# EAGLE design RelayController (EAGLE 7.5.0)
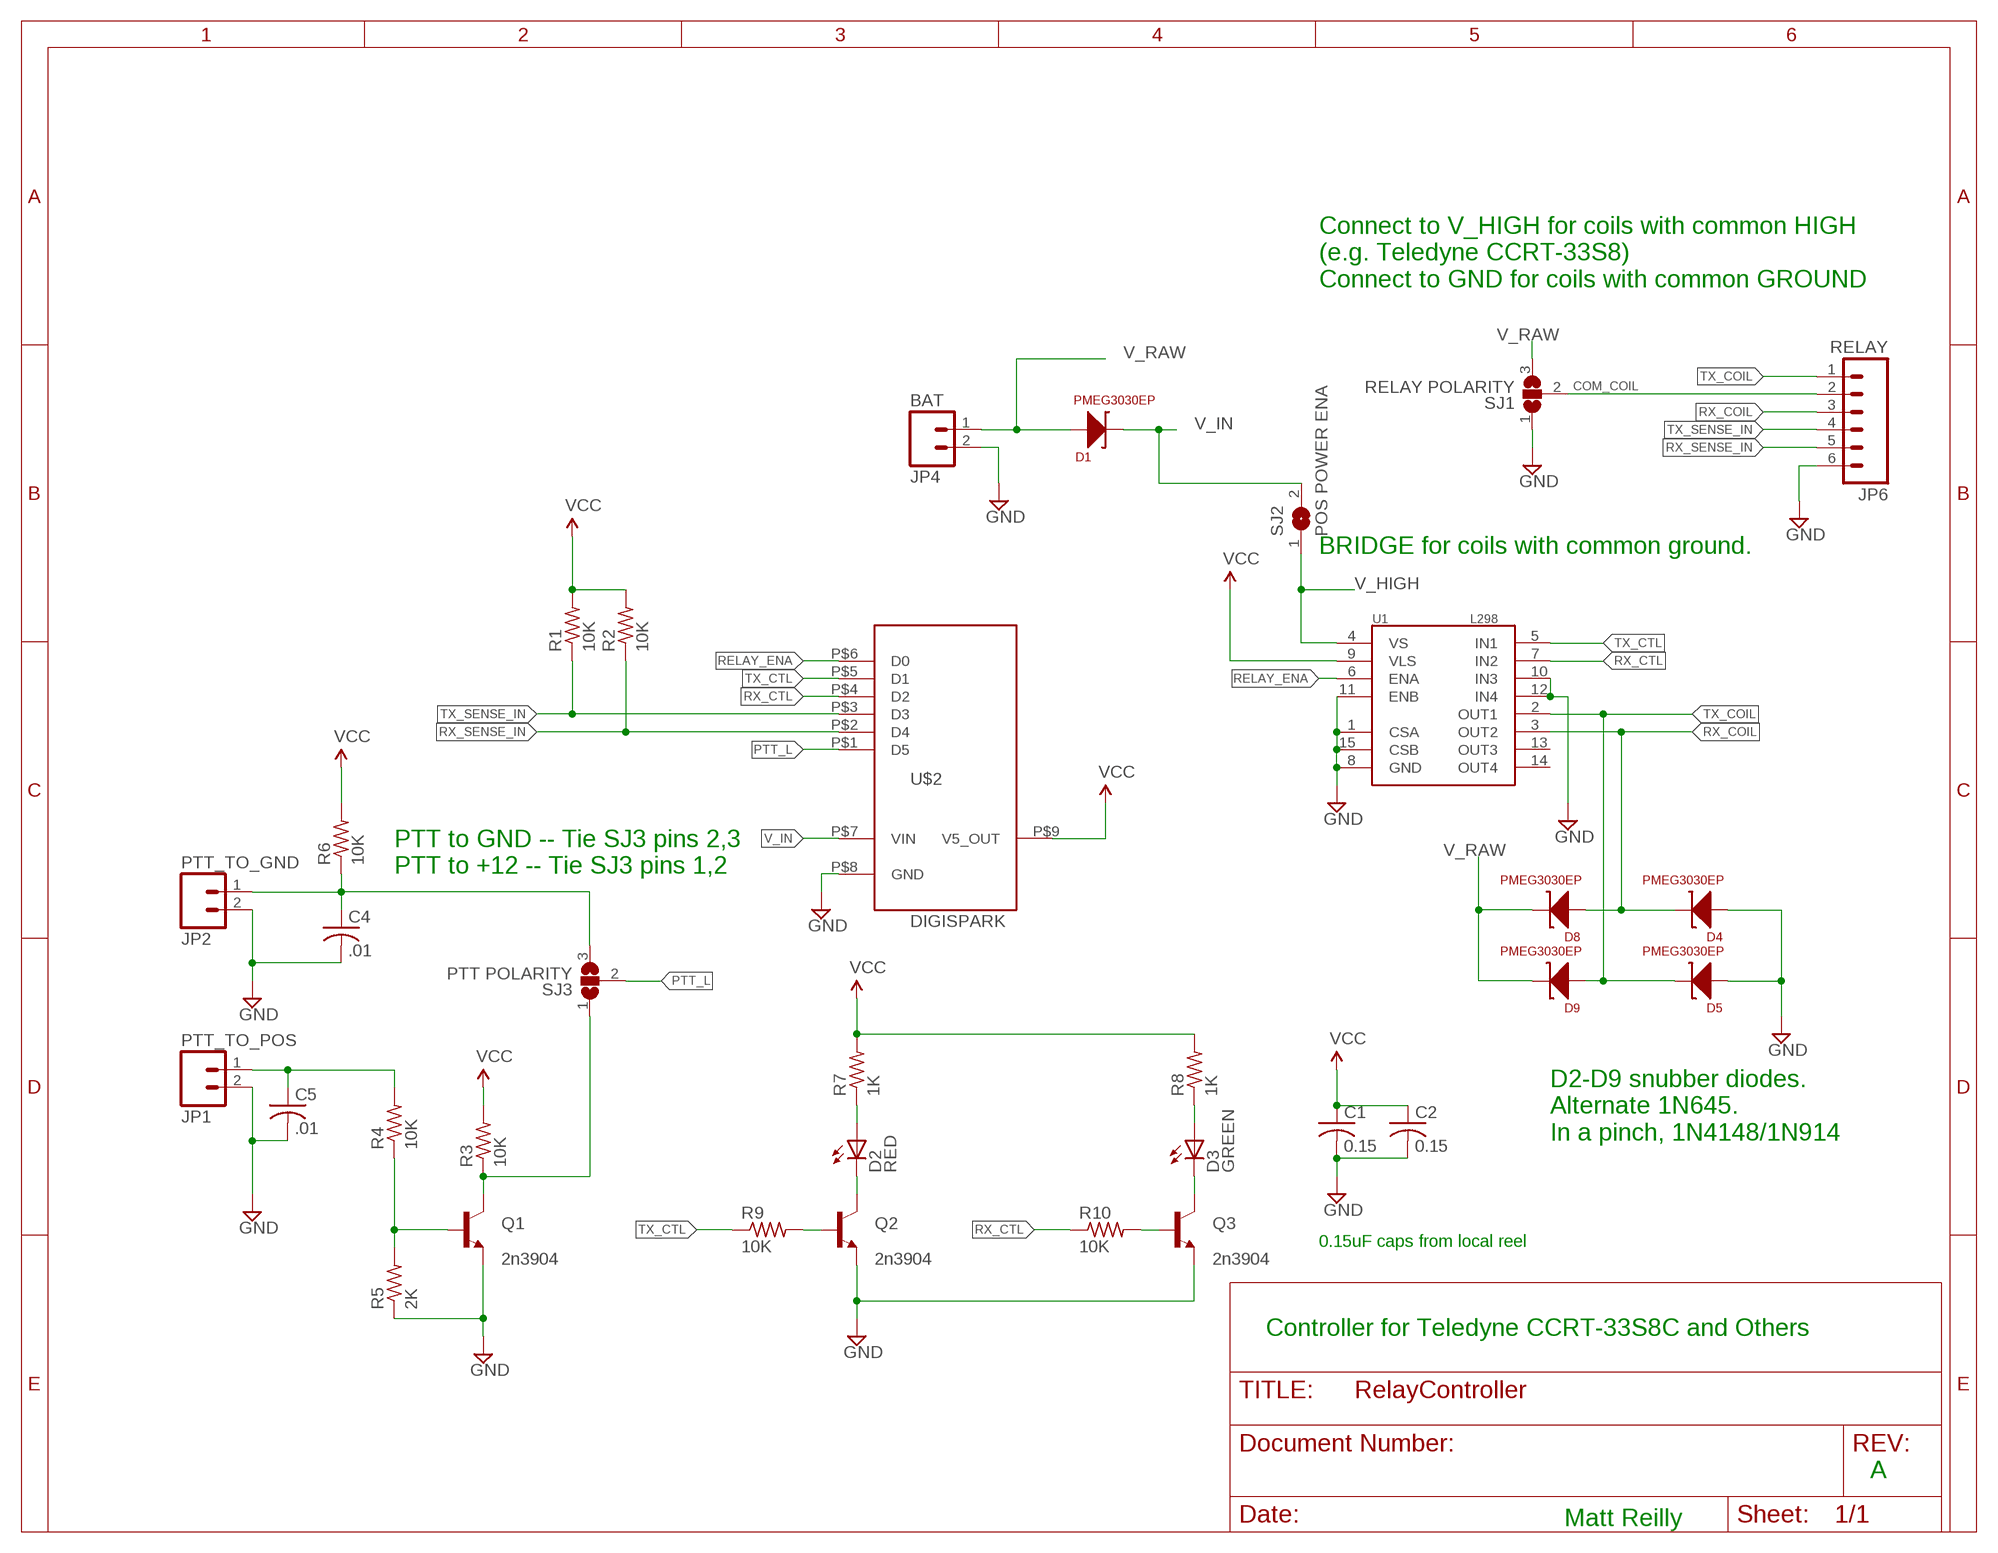
[diagram p0: schematic, sheet 1]

## Parts
C1  0.15  C-USC1206K  [C1206K]
C2  0.15  C-USC1206K  [C1206K]
C4  .01  C-USC1206K  [C1206K]
C5  .01  C-USC1206K  [C1206K]
D1  PMEG3030EP  [SOD128]
D2  RED  LED3MM  [LED3MM]
D3  GREEN  LED3MM  [LED3MM]
D4  PMEG3030EP  [SOD128]
D5  PMEG3030EP  [SOD128]
D8  PMEG3030EP  [SOD128]
D9  PMEG3030EP  [SOD128]
JP1  PTT_TO_POS  M025MM  [SCREWTERMINAL-5MM-2]
JP2  PTT_TO_GND  M025MM  [SCREWTERMINAL-5MM-2]
JP4  BAT  M025MM  [SCREWTERMINAL-5MM-2]
JP6  RELAY  M06POLAR  [MOLEX-1X6]
Q1  2n3904  2N3904  [TO92]
Q2  2n3904  2N3904  [TO92]
Q3  2n3904  2N3904  [TO92]
R1  10K  R-US_R1206  [R1206]
R2  10K  R-US_R1206  [R1206]
R3  10K  R-US_R1206  [R1206]
R4  10K  R-US_R1206  [R1206]
R5  2K  R-US_R1206  [R1206]
R6  10K  R-US_R1206  [R1206]
R7  1K  R-US_R1206  [R1206]
R8  1K  R-US_R1206  [R1206]
R9  10K  R-US_R1206  [R1206]
R10  10K  R-US_R1206  [R1206]
SJ1  RELAY POLARITY  SJ2WW  [SJ_2W]
SJ2  POS POWER ENA  SJW  [SJW]
SJ3  PTT POLARITY  SJ2WW  [SJ_2W]
U1  L298  [MULTIWATT15]
U$2  DIGISPARK  [DIGISPARK_FP]

## Nets
COM_COIL: JP6.2 SJ1.2
GND: C1.2 C2.2 C4.2 C5.2 D4.P$1(A) D5.P$1(A) JP1.2 JP2.2 JP4.2 JP6.6 Q1.3(E) Q2.3(E) Q3.3(E) R5.1 SJ1.1 U1.1(CSA) U1.8(GND) U1.10(IN3) U1.11(ENB) U1.12(IN4) U1.15(CSB) U$2.P$8(GND)
N$1: C5.1 JP1.1 R4.2
N$2: Q1.1(C) R3.1 SJ3.1
N$3: D3.A R8.1
N$4: Q1.2(B) R4.1 R5.2
N$5: C4.1 JP2.1 R6.1 SJ3.3
N$6: D2.A R7.1
N$7: D2.K(C) Q2.1(C)
N$8: D3.K(C) Q3.1(C)
N$9: Q2.2(B) R9.2
N$10: Q3.2(B) R10.2
PTT_L: SJ3.2 U$2.P$1(D5)
RELAY_ENA: U1.6(ENA) U$2.P$6(D0)
RX_COIL: D4.P$2(C) D8.P$1(A) JP6.3 U1.3(OUT2)
RX_CTL: R10.1 U1.7(IN2) U$2.P$4(D2)
RX_SENSE_IN: JP6.5 R2.1 U$2.P$2(D4)
TX_COIL: D5.P$2(C) D9.P$1(A) JP6.1 U1.2(OUT1)
TX_CTL: R9.1 U1.5(IN1) U$2.P$5(D1)
TX_SENSE_IN: JP6.4 R1.1 U$2.P$3(D3)
V_HIGH: SJ2.1 U1.4(VS)
V_IN: D1.P$2(C) SJ2.2 U$2.P$7(VIN)
V_RAW: D1.P$1(A) D8.P$2(C) D9.P$2(C) JP4.1 SJ1.3
VCC: C1.1 C2.1 R1.2 R2.2 R3.2 R6.2 R7.2 R8.2 U1.9(VLS) U$2.P$9(V5_OUT)
Unconnected: U1.13(OUT3) U1.14(OUT4)

## Notes on the sheet
- Connect to V_HIGH for coils with common HIGH
  (e.g. Teledyne CCRT-33S8)
  Connect to GND for coils with common GROUND
- BRIDGE for coils with common ground.
- PTT to GND -- Tie SJ3 pins 2,3
  PTT to +12 -- Tie SJ3 pins 1,2
- D2-D9 snubber diodes. 
  Alternate 1N645. 
  In a pinch, 1N4148/1N914
- 0.15uF caps from local reel
- Controller for Teledyne CCRT-33S8C and Others
- A
- Matt Reilly

## Library data of the parts
C1 C2 C4 C5 = resistor:C-US: CAPACITOR, American symbol
D1 D4 D5 D8 D9 = kb1vc_robot_parts:PMEG3030EP
D2 D3 = led:LED: LED OSRAM: - CHIPLED LG R971, LG N971, LY N971, LG Q971, LY Q971, LO R971, LY R971 LH N974, LH R974 LS Q976, LO Q976, LY Q976 LO Q996 - Hyper CHIPLED LW Q18S LB Q993, LB Q99A, LB R99A - SideLED LS A670, LO A670, LY A670, LG A670, LP A670 LB A673, LV A673, LT A673, LW A673 LH A674 LY A675 LS A676, LA A676, LO A676, LY A676, LW A676 LS A679, LY A679, LG A679 - Hyper Micro SIDELED® LS Y876, LA Y876, LO Y876, LY Y876 LT Y87S - SmartLED LW L88C, LW L88S LB L89C, LB L89S, LG L890 LS L89K, LO L89K, LY L89K LS L896, LA L896, LO L896, LY L896 - TOPLED LS T670, LO T670, LY T670, LG T670, LP T670 LSG T670, LSP T670, LSY T670, LOP T670, LYG T670 LG T671, LOG T671, LSG T671 LB T673, LV T673, LT T673, LW T673 LH T674 LS T676, LA T676, LO T676, LY T676, LB T676, LH T676, LSB T676, LW T676 LB T67C, LV T67C, LT T67C, LS T67K, LO T67K, LY T67K, LW E67C LS E67B, LA E67B, LO E67B, LY E67B, LB E67C, LV E67C, LT E67C LW T67C LS T679, LY T679, LG T679 LS T770, LO T770, LY T770, LG T770, LP T770 LB T773, LV T773, LT T773, LW T773 LH T774 LS E675, LA E675, LY E675, LS T675 LS T776, LA T776, LO T776, LY T776, LB T776 LHGB T686 LT T68C, LB T68C - Hyper Mini TOPLED® LB M676 - Mini TOPLED Santana® LG M470 LS M47K, LO M47K, LY M47K Source: http://www.osram.convergy.de LUXEON: - LUMILED® LXK2-PW12-R00, LXK2-PW12-S00, LXK2-PW14-U00, LXK2-PW14-V00 LXK2-PM12-R00, LXK2-PM12-S00, LXK2-PM14-U00 LXK2-PE12-Q00, LXK2-PE12-R00, LXK2-PE12-S00, LXK2-PE14-T00, LXK2-PE14-U00 LXK2-PB12-K00, LXK2-PB12-L00, LXK2-PB12-M00, LXK2-PB14-N00, LXK2-PB14-P00, LXK2-PB14-Q00 LXK2-PR12-L00, LXK2-PR12-M00, LXK2-PR14-Q00, LXK2-PR14-R00 LXK2-PD12-Q00, LXK2-PD12-R00, LXK2-PD12-S00 LXK2-PH12-R00, LXK2-PH12-S00 LXK2-PL12-P00, LXK2-PL12-Q00, LXK2-PL12-R00 Source: www.luxeon.com KINGBRIGHT: KA-3528ASYC Source: www.kingbright.com
JP1 JP2 JP4 = SparkFun-Connectors:M02: Standard 2-pin 0.1" header. Use with - straight break away headers ( PRT-00116) - right angle break away headers (PRT-00553) - swiss pins (PRT-00743) - machine pins (PRT-00117) - female headers (PRT-00115) Molex polarized connector foot print use with: PRT-08233 with associated crimp pins and housings. 2.54_SCREWTERM for use with PRT-10571. 3.5mm Screw Terminal footprints for PRT-08084 5mm Screw Terminal footprints for use with PRT-08432; STOREFRONT_ID: PRT-08432
JP6 = SparkFun-Connectors:M06: Header 6 Standard 6-pin 0.1" header. Use with straight break away headers (SKU : PRT-00116), right angle break away headers (PRT-00553), swiss pins (PRT-00743), machine pins (PRT-00117), and female headers (PRT-00115). Molex polarized connector foot print use with SKU : PRT-08094 with associated crimp pins and housings. NOTES ON THE VARIANTS LOCK and LOCK_LONGPADS... This footprint was designed to help hold the alignment of a through-hole component (i.e. 6-pin header) while soldering it into place. You may notice that each hole has been shifted either up or down by 0.005 of an inch from it's more standard position (which is a perfectly straight line). This slight alteration caused the pins (the squares in the middle) to touch the edges of the holes. Because they are alternating, it causes a "brace" to hold the component in place. 0.005 has proven to be the perfect amount of "off-center" position when using our standard breakaway headers. Although looks a little odd when you look at the bare footprint, once you have a header in there, the alteration is very hard to notice. Also,if you push a header all the way into place, it is covered up entirely on the bottom side. This idea of altering the position of holes to aid alignment will be further integrated into the Sparkfun Library for other footprints. It can help hold any component with 3 or more connection pins.
Q1-Q3 = transistor:2N3904: NPN TRANSISTOR
R1-R10 = rcl:R-US_: RESISTOR, American symbol
SJ1 SJ3 = jumper:SJ2W: SMD solder JUMPER
SJ2 = jumper:SJ: SMD solder JUMPER
U1 = SparkFun-PowerIC:L298: L298 Dual Full Bridge Driver
U$2 = kb1vc_Arduino_Parts:DIGISPARK: Digispark -- ATTiny arduino with minimal footprint

## Board
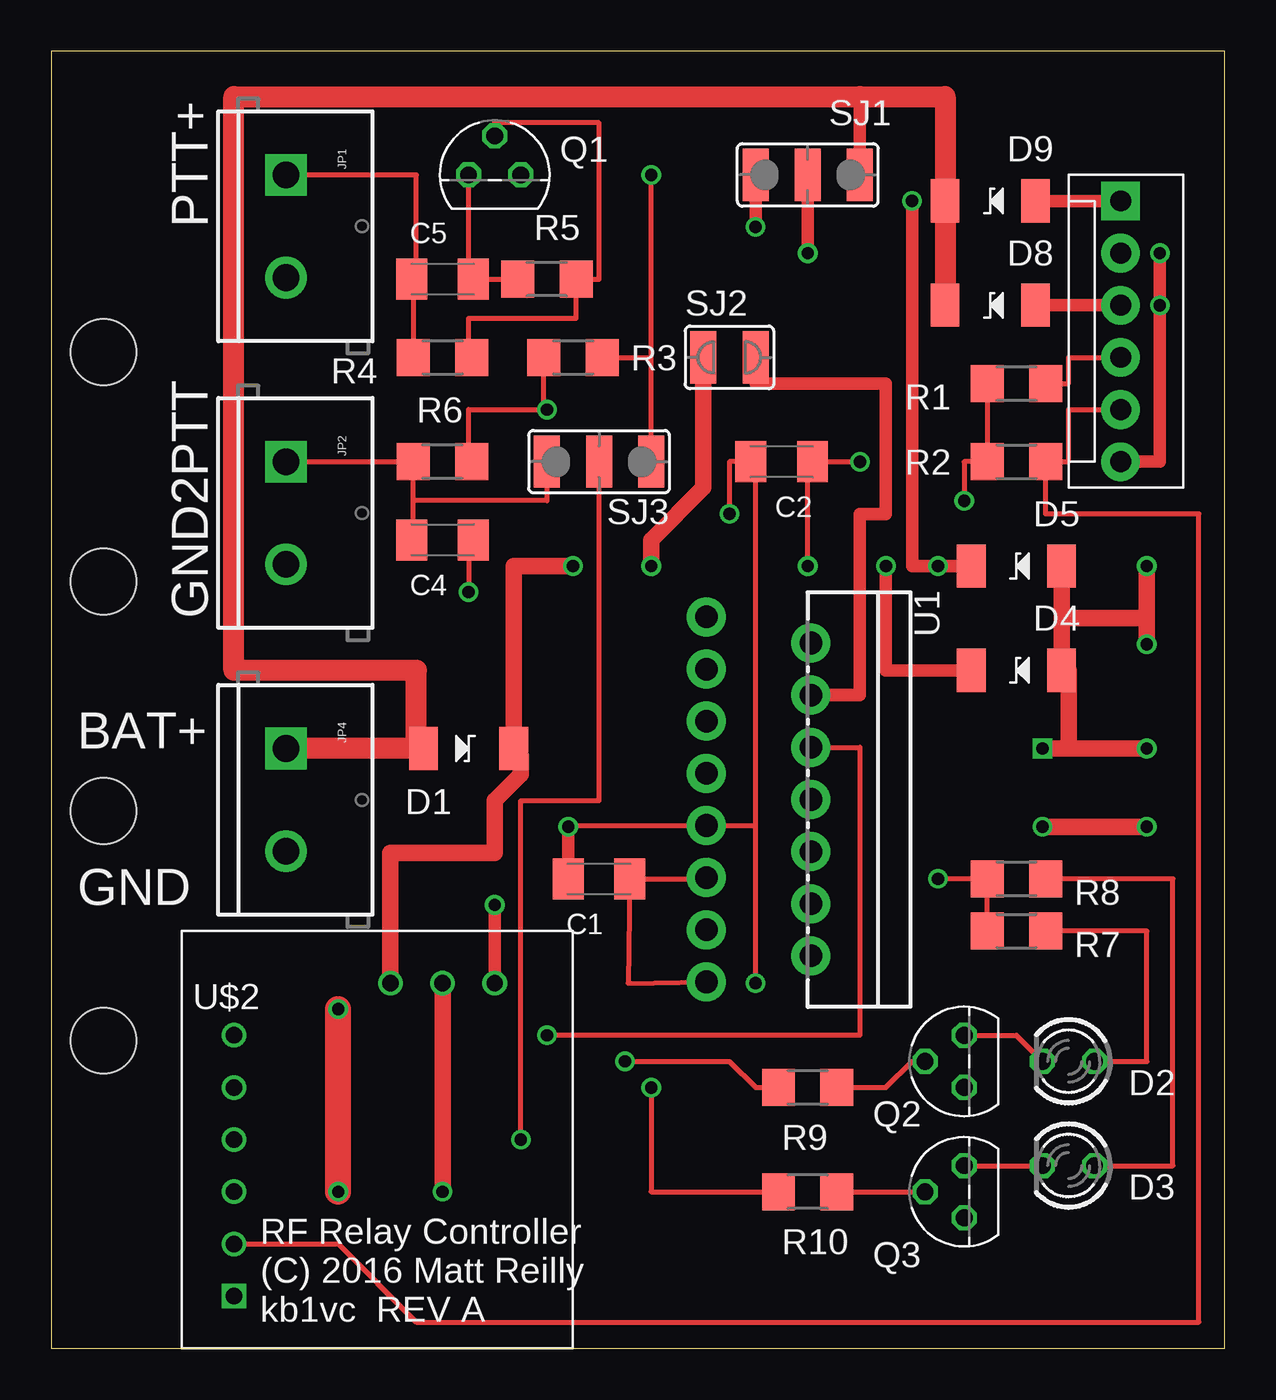
[diagram p1: board, top side]
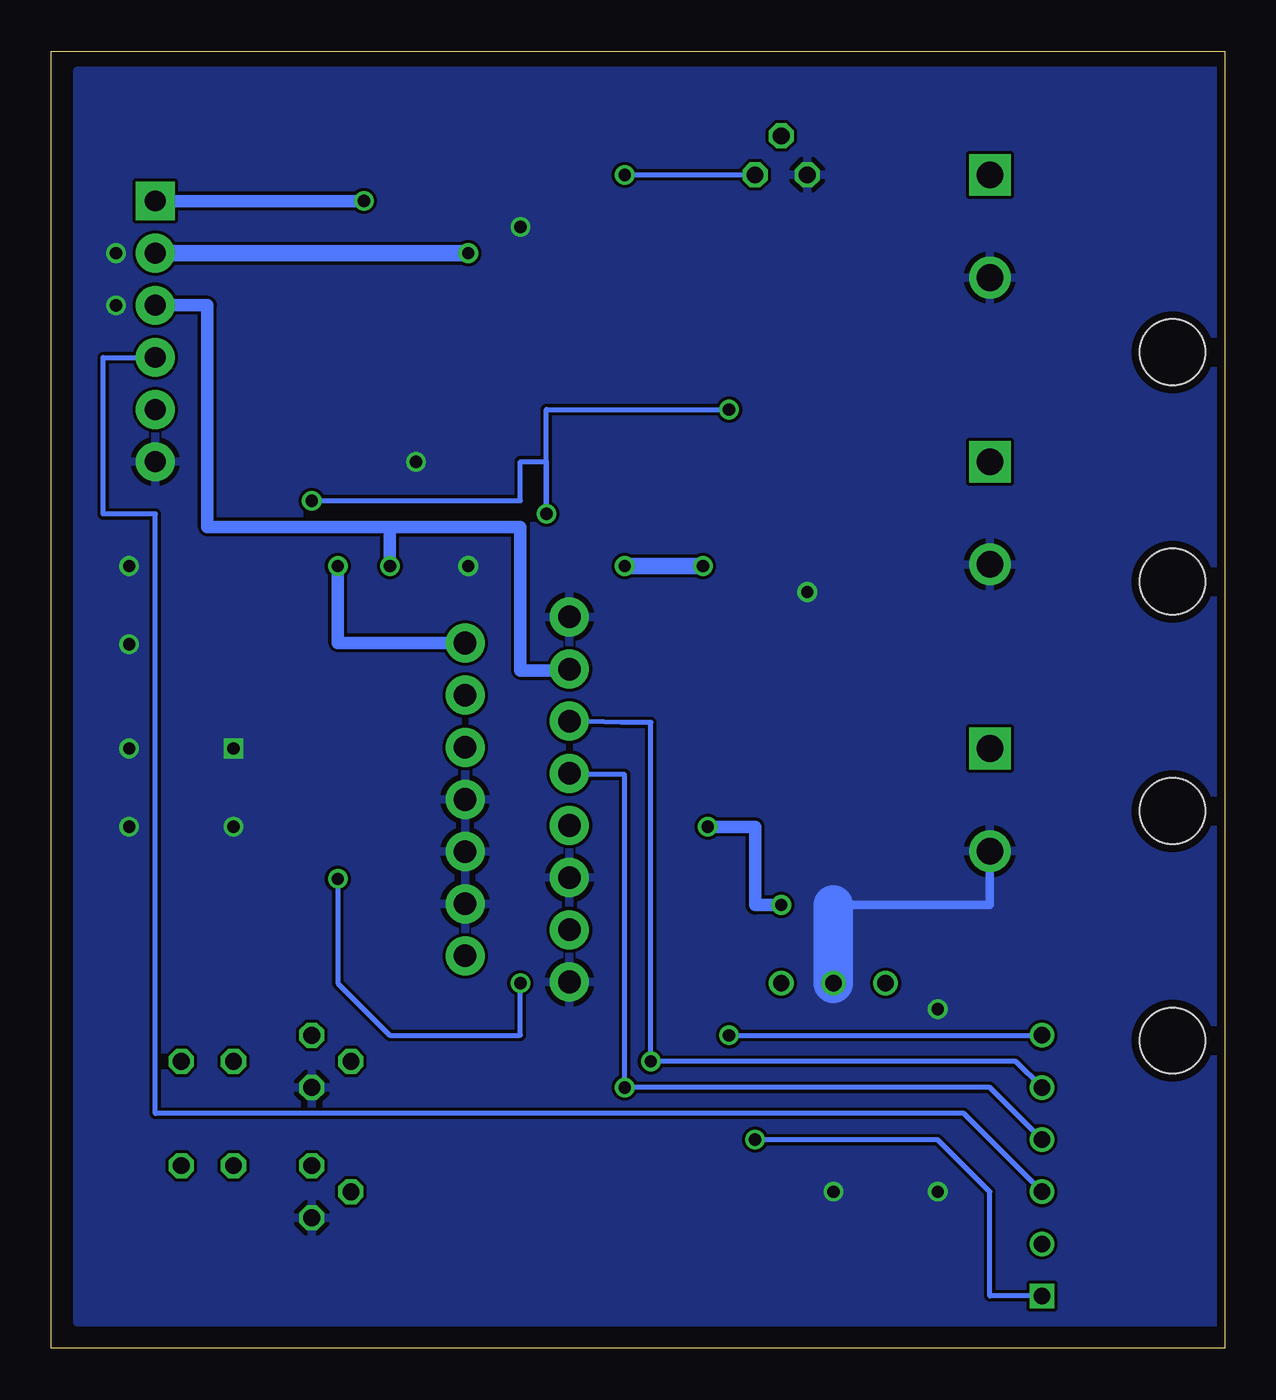
[diagram p2: board, bottom side, seen from below]

Size 57.13 x 63.17 mm. Coordinates in mm from the lower left corner, seen from the top.
Outline: 0,0 57.13,0 57.13,63.17 0,63.17 0,0
Copper layers (1*16): Top 0.0356mm / dielectric 1.5011mm / Bottom 0.0356mm
Design rules "oshpark-2layer": minimum track width 6mil, minimum drill 13mil, track to track 6mil, track to pad 6mil, pad to pad 6mil, via to via 6mil, smd to smd 6mil, copper to edge 15mil, drill to drill 6mil, minimum pad ring 7mil, minimum via ring 7mil, stop-mask expansion 2.5mil, vias tented up to drill 0mil, thermal gap 10mil
Holes 3.2 mm at 2.54,14.99 2.54,26.16 2.54,37.34 2.54,48.51

### Footprints (pad centres in the part's own frame; a part is rotated, then mirrored left to right if it is on the bottom)
C1206K = smd 1.5 x 2: 1 -1.5,0; 2 1.5,0
SOD128 = smd 1.4 x 2.1: P$1 -2.2,0; P$2 2.2,0
LED3MM = drill 0.813 octagon: A -1.27,0; K 1.27,0
SCREWTERMINAL-5MM-2 = drill 1.3 pad 2.032 square: 1 0,0 | drill 1.3 pad 2.032: 2 5,0
MOLEX-1X6 = drill 1.016 pad 1.88 square: 1 0,0 | drill 1.016 pad 1.88: 2 2.54,0; 3 5.08,0; 4 7.62,0; 5 10.16,0; 6 12.7,0
TO92 = drill 0.813 octagon: 1 1.27,0; 2 0,1.905; 3 -1.27,0
R1206 = smd 1.6 x 1.803: 1 -1.422,0; 2 1.422,0
SJ_2W = smd 1.27 x 2.54: 1 -2.54,0; 2 0,0; 3 2.54,0
SJW = smd 1.27 x 2.54: 1 -1.27,0; 2 1.27,0
MULTIWATT15 = drill 1.1 pad 1.9: 1 -8.95,-2.39; 2 -7.68,2.69; 3 -6.41,-2.39; 4 -5.14,2.69; 5 -3.87,-2.39; 6 -2.6,2.69; 7 -1.33,-2.39; 8 -0.06,2.69; 9 1.21,-2.39; 10 2.48,2.69; 11 3.75,-2.39; 12 5.02,2.69; 13 6.29,-2.39; 14 7.56,2.69; 15 8.83,-2.39
DIGISPARK_FP = drill 0.8 square: P$1 6.35,6.35 | drill 0.8: P$2 6.35,3.81; P$3 6.35,1.27; P$4 6.35,-1.27; P$5 6.35,-3.81; P$6 6.35,-6.35; P$7 -1.27,-8.89; P$8 -3.81,-8.89; P$9 -6.35,-8.89

### Placement (x,y rotation side)
C1  26.67,22.86 0 top
C2  35.56,43.18 0 top
C4  19.05,39.37 0 top
C5  19.05,52.07 0 top
D1  20.32,29.21 0 top
D2  49.53,13.97 180 top
D3  49.53,8.89 180 top
D4  46.99,33.02 180 top
D5  46.99,38.1 180 top
D8  45.72,50.8 180 top
D9  45.72,55.88 180 top
JP1  11.43,57.15 270 top
JP2  11.43,43.18 270 top
JP4  11.43,29.21 270 top
JP6  52.07,55.88 270 top
Q1  21.59,57.15 0 top
Q2  44.45,13.97 90 top
Q3  44.45,7.62 90 top
R1  46.99,46.99 180 top
R2  46.99,43.18 180 top
R3  25.4,48.26 180 top
R4  19.05,48.26 180 top
R5  24.13,52.07 0 top
R6  19.05,43.18 0 top
R7  46.99,20.32 180 top
R8  46.99,22.86 180 top
R9  36.83,12.7 0 top
R10  36.83,7.62 0 top
SJ1  36.83,57.15 0 top
SJ2  33.02,48.26 180 top
SJ3  26.67,43.18 180 top
U1  34.29,26.67 270 top
U$2  15.24,8.89 180 top

### Tracks (layer width: path | path; a pad name or v marks a point on that pad's centre or on a via)
COM_COIL  (via drill 0.6)
  Top 0.61: v36.83,53.34 SJ1.2
  Bottom 0.813: JP6.2 v36.83,53.34
GND  (via drill 0.6)
  Top 0.254: U1.15 28.09,17.78 C1.2 31.9,22.86 U1.11 | C4.2 20.32,39.37 v20.32,36.83 | R5.1 C5.2 20.32,52.07 Q1.3 | C2.2 v39.37,43.18 36.83,43.18 v36.83,38.1
  Top 0.61: SJ1.1 v34.29,54.61 | JP6.6 53.98,43.18 v53.98,50.8 v53.98,53.34
  Top 0.813: D5.P$1 D4.P$1 49.53,33.02 49.53,29.21 v48.26,29.21 v53.34,29.21 | 53.34,35.56 v53.34,38.1 | v53.34,25.4 v48.26,25.4 | v53.34,34.29 53.34,35.56 | 53.34,35.56 49.53,35.56 | v19.05,7.62 U$2.P$8
  Top 1.27: v13.97,7.62 v13.97,16.51
  Bottom 0.406: 19.05,21.59 11.43,21.59 JP4.2
  Bottom 1.93: U$2.P$8 19.05,21.59
  pour Bottom: 0,62.23 55.88,62.23 55.88,1.27 0,1.27
N$1
  Top 0.254: JP1.1 17.78,57.15 17.78,52.07 C5.1 17.63,52.07 R4.2
N$2  (via drill 0.6)
  Top 0.254: SJ3.1 29.21,48.26 | R3.1 29.21,48.26 | 29.21,48.26 v29.21,57.15
  Bottom 0.254: v29.21,57.15 Q1.1
N$3
  Top 0.254: D3.A 54.61,8.89 54.61,22.86 R8.1
N$4
  Top 0.254: Q1.2 21.59,59.69 26.67,59.69 26.67,52.07 R5.2 25.55,50.16 20.32,50.16 20.32,48.26 R4.1
N$5
  Top 0.254: JP2.1 R6.1 17.63,41.27 | C4.1 17.63,39.37 17.63,41.27 | SJ3.3 24.13,41.27 17.63,41.27
N$6
  Top 0.254: D2.A 53.34,13.97 53.34,20.32 R7.1
N$7
  Top 0.254: Q2.1 46.99,15.24 D2.K
N$8
  Top 0.254: Q3.1 D3.K
N$9
  Top 0.254: R9.2 40.64,12.7 41.91,13.97 Q2.2
N$10
  Top 0.254: R10.2 Q3.2
PTT_L  (via drill 0.6)
  Top 0.254: v22.86,10.16 22.86,26.67 26.67,26.67 SJ3.2
  Bottom 0.254: U$2.P$1 11.43,2.54 11.43,7.62 13.97,10.16 v22.86,10.16
RELAY_ENA  (via drill 0.6)
  Top 0.254: U1.6 39.37,29.27 39.37,15.24 v24.13,15.24
  Bottom 0.254: v24.13,15.24 U$2.P$6
RX_COIL  (via drill 0.6)
  Top 0.61: JP6.3 D8.P$1 | D4.P$2 40.64,33.02 v40.64,38.1
  Bottom 0.254: 31.9,33.02 U1.3
  Bottom 0.61: v40.64,38.1 40.64,40.01 | 40.64,40.01 34.29,40.01 34.29,33.02 31.9,33.02 | 40.64,40.01 49.53,40.01 49.53,50.8 JP6.3
RX_CTL  (via drill 0.6)
  Top 0.254: v29.21,12.7 29.21,7.62 R10.1
  Bottom 0.254: U$2.P$4 11.43,12.7 v29.21,12.7 29.21,27.94 31.9,27.94 U1.7
RX_SENSE_IN
  Top 0.254: U$2.P$2 13.97,5.08 17.78,1.27 55.88,1.27 55.88,40.64 48.41,40.64 R2.1 49.53,43.18 49.53,45.72 JP6.5
TX_COIL  (via drill 0.6)
  Top 0.61: JP6.1 D9.P$1 | v43.18,38.1 D5.P$2 41.91,38.1 v41.91,55.88
  Bottom 0.61: U1.2 43.18,34.35 v43.18,38.1 | v41.91,55.88 JP6.1
TX_CTL  (via drill 0.6)
  Top 0.254: v27.94,13.97 33.02,13.97 34.29,12.7 R9.1
  Bottom 0.254: U$2.P$5 10.16,13.97 v27.94,13.97 27.94,30.48 29.36,30.48 U1.5
TX_SENSE_IN
  Top 0.254: R1.1 49.53,46.99 49.53,48.26 JP6.4
  Bottom 0.254: U$2.P$3 12.7,11.43 52.07,11.43 52.07,40.64 54.61,40.64 54.61,48.26 JP6.4
V_HIGH
  Top 0.61: SJ2.1 34.29,46.99 40.64,46.99 40.64,40.64 39.37,40.64 39.37,31.81 U1.4
V_IN  (via drill 0.6)
  Top 0.813: U$2.P$7 16.51,24.13 21.59,24.13 21.59,26.67 22.86,27.94 22.86,28.87 D1.P$2 22.52,38.1 v25.4,38.1 | v29.21,38.1 29.21,39.37 31.75,41.91 SJ2.2
  Bottom 0.813: v25.4,38.1 v29.21,38.1
V_RAW
  Top 0.61: SJ1.3 39.37,60.96
  Top 1.016: JP4.1 D1.P$1 17.78,29.21 17.78,33.02 8.89,33.02 8.89,60.96 39.37,60.96 43.52,60.96 D9.P$2 D8.P$2
VCC  (via drill 0.6)
  Top 0.254: R6.2 20.32,43.18 20.32,45.72 23.98,45.72 | v33.02,40.64 33.02,43.18 C2.1 34.29,43.18 34.29,25.46 | v24.13,45.72 23.98,45.72 | 23.98,45.72 R3.2 | R1.2 R2.2 44.45,43.18 v44.45,41.27 | 34.29,25.46 U1.9 25.4,25.46 25.4,25.4 v25.17,25.4 | R7.2 R8.2 v43.18,22.86 | v34.29,17.78 34.29,25.46
  Top 0.61: U$2.P$9 v21.59,21.59 | v25.17,25.4 C1.1
  Bottom 0.254: v24.13,45.72 33.02,45.72 v33.02,40.64 33.02,43.18 34.29,43.18 34.29,41.27 v44.45,41.27 | v43.18,22.86 43.18,17.78 40.64,15.24 34.29,15.24 v34.29,17.78
  Bottom 0.61: v21.59,21.59 22.86,21.59 22.86,25.4 v25.17,25.4

### Text on the board
tNames: PTT+ | GND2PTT | BAT+ | GND | RF Relay Controller / (C) 2016 Matt Reilly / kb1vc REV A